# Altium schematic sheet 11-GPS_WIFI.SchDoc
size A4
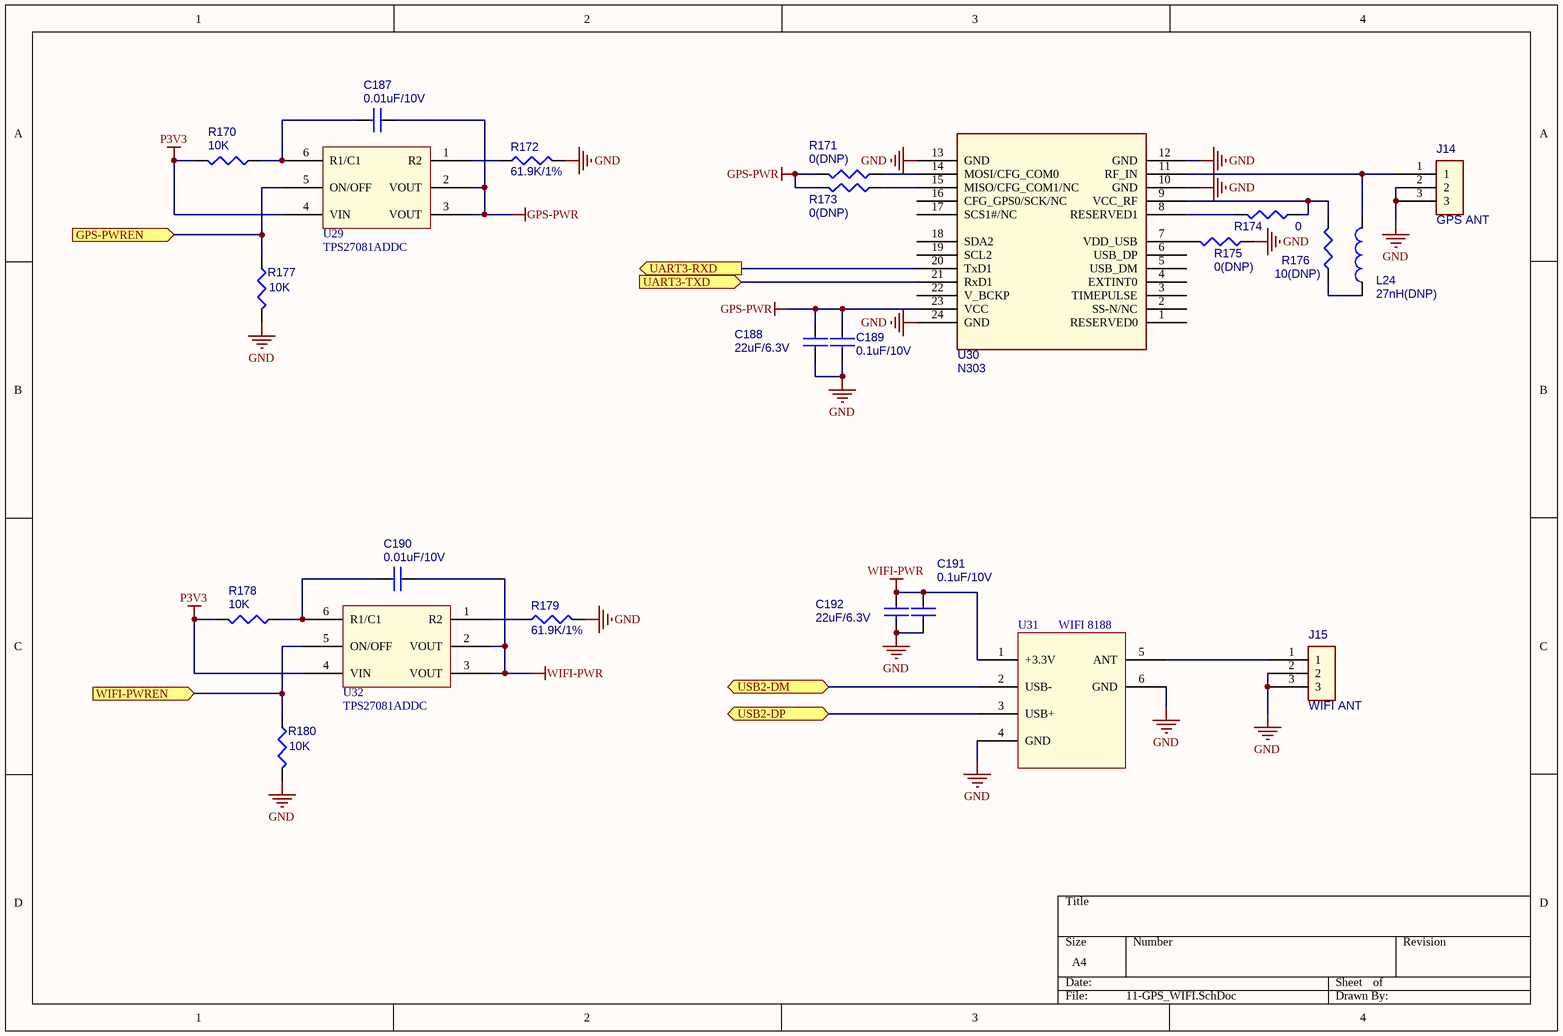
[diagram p0: 11-GPS_WIFI.SchDoc]

## Parts
C187  0.01uF/10V  [0402]
C188  22uF/6.3V  [0805]
C189  0.1uF/10V  [0402]
C190  0.01uF/10V  [0402]
C191  0.1uF/10V  [0402]
C192  22uF/6.3V  [0805]
J14  GPS ANT  [ANT]
J15  WIFI ANT  [ANT]
L24  27nH(DNP)  [0603]
R170  10K  [0402]
R171  0(DNP)  [0402]
R172  61.9K/1%  [0402]
R173  0(DNP)  [0402]
R174  0  [0402]
R175  0(DNP)  [0402]
R176  10(DNP)  [0402]
R177  10K  [0402]
R178  10K  [0402]
R179  61.9K/1%  [0402]
R180  10K  [0402]
U29  TPS27081ADDC  [SOT23-6]
U30  N303  [NEO-6]
U31  WIFI 8188  [WIFI8188]
U32  TPS27081ADDC  [SOT23-6]

## Ports
GPS-PWREN (in), UART3-RXD (out), UART3-TXD (in), USB2-DM, USB2-DP, WIFI-PWREN (in)

## Nets
GND: C188.2 C189.2 C191.2 C192.2 J14.2 J14.3 J15.2 J15.3 R172.1 R175.1 R177.1 R179.1 R180.1 U30.10(GND) U30.12(GND) U30.13(GND) U30.24(GND) U31.4(GND) U31.6(GND)
GPS-PWR: C187.1 C188.1 C189.1 R171.2 R173.2 U29.2(VOUT) U29.3(VOUT) U30.23(VCC)
P3V3: R170.1 R178.1 U29.4(VIN) U32.4(VIN)
WIFI-PWR: C190.1 C191.1 C192.1 U31.1(+3.3V) U32.2(VOUT) U32.3(VOUT)
GPS-PWREN: R177.2 U29.5(ON/OFF) ; port GPS-PWREN
UART3-RXD: U30.20(TxD1) ; port UART3-RXD
UART3-TXD: U30.21(RxD1) ; port UART3-TXD
USB2-DM: U31.2(USB-) ; port USB2-DM
USB2-DP: U31.3(USB+) ; port USB2-DP
WIFI-PWREN: R180.2 U32.5(ON/OFF) ; port WIFI-PWREN
NetC187_2: C187.2 R170.2 U29.6(R1/C1)
NetC190_2: C190.2 R178.2 U32.6(R1/C1)
NetJ14_1: J14.1 L24.2 U30.11(RF_IN)
NetJ15_1: J15.1 U31.5(ANT)
NetL24_1: L24.1 R176.1
NetR171_1: R171.1 U30.14(MOSI/CFG_COM0)
NetR172_2: R172.2 U29.1(R2)
NetR173_1: R173.1 U30.15(MISO/CFG_COM1/NC)
NetR174_1: R174.1 R176.2 U30.9(VCC_RF)
NetR174_2: R174.2 U30.8(RESERVED1)
NetR175_2: R175.2 U30.7(VDD_USB)
NetR179_2: R179.2 U32.1(R2)

Not connected (* = marked no-connect by the designer): U30 1(RESERVED0) 2(SS-N/NC) 3(TIMEPULSE) 4(EXTINT0) 5(USB_DM) 6(USB_DP) 16(CFG_GPS0/SCK/NC) 17(SCS1#/NC) 18(SDA2) 19(SCL2) 22(V_BCKP)

## Library data of the parts
C187-C192 = P_CAP NP
J14 J15 = HRS_U_0.FL-R-SMT-10
L24 = 2.2UH_LPS3015-222MLC_1.5A_20%~D
R170-R180 = P_R
U29 U32 = TPS27081A
U30 = NEO-5M